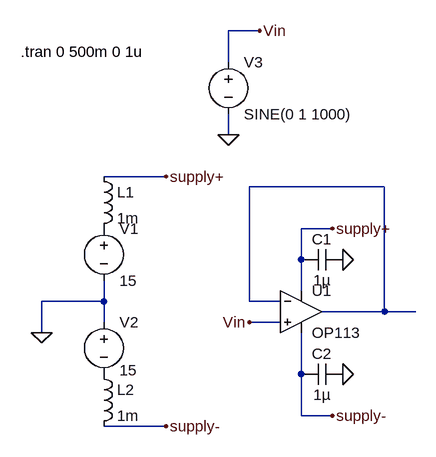
[diagram p0: schematic PreLab 4.asc]
PreLab 4.asc, the LTspice schematic file:
Version 4
SHEET 1 880 680
WIRE 144 -208 96 -208
WIRE 96 -160 96 -208
WIRE 96 -48 96 -80
WIRE 0 16 -96 16
WIRE 336 32 128 32
WIRE 256 96 208 96
WIRE 208 144 208 96
WIRE 208 192 208 144
WIRE -96 208 -96 176
WIRE -96 208 -192 208
WIRE 128 208 128 32
WIRE 176 208 128 208
WIRE 336 224 336 32
WIRE 336 224 240 224
WIRE 384 224 336 224
WIRE -96 240 -96 208
WIRE 176 240 128 240
WIRE -192 256 -192 208
WIRE 208 320 208 256
WIRE 208 384 208 320
WIRE 256 384 208 384
WIRE 0 400 -96 400
FLAG -192 256 0
FLAG 256 96 supply+
FLAG 256 384 supply-
FLAG 0 400 supply-
FLAG 0 16 supply+
FLAG 96 -48 0
FLAG 144 -208 Vin
FLAG 128 240 Vin
FLAG 272 144 0
FLAG 272 320 0
SYMBOL voltage -96 80 R0
SYMATTR InstName V1
SYMATTR Value 15
SYMBOL voltage -96 224 R0
WINDOW 3 24 90 Left 2
SYMATTR InstName V2
SYMATTR Value 15
SYMBOL OpAmps/OP113 208 160 R0
SYMATTR InstName U1
SYMBOL voltage 96 -176 R0
SYMATTR InstName V3
SYMATTR Value SINE(0 1 1000)
SYMATTR Value2 AC 1 0
SYMBOL ind -112 0 R0
SYMATTR InstName L1
SYMATTR Value 1m
SYMBOL ind -112 304 R0
SYMATTR InstName L2
SYMATTR Value 1m
SYMBOL cap 272 128 R90
WINDOW 0 0 32 VBottom 2
WINDOW 3 32 32 VTop 2
SYMATTR InstName C1
SYMATTR Value 1µ
SYMBOL cap 272 304 R90
WINDOW 0 0 32 VBottom 2
WINDOW 3 32 32 VTop 2
SYMATTR InstName C2
SYMATTR Value 1µ
TEXT -224 -176 Left 2 !.tran 0 500m 0 1u

The netlist it stands for:
* PreLab 4.asc
V1 P001 0 15
V2 0 P002 15
XU1 Vin N001 supply+ supply- N001 OP113  ; pins In+ In- V+ V- OUT
V3 Vin 0 SINE(0 1 1000) AC 1 0
L1 supply+ P001 1m
L2 P002 supply- 1m
C1 0 supply+ 1µ
C2 0 supply- 1µ
.tran 0 500m 0 1u
.lib ADI.lib
.backanno
.end